# Altium schematic sheet Sheet1.SchDoc
size A2; SheetNumber: 1; SheetTotal: 1
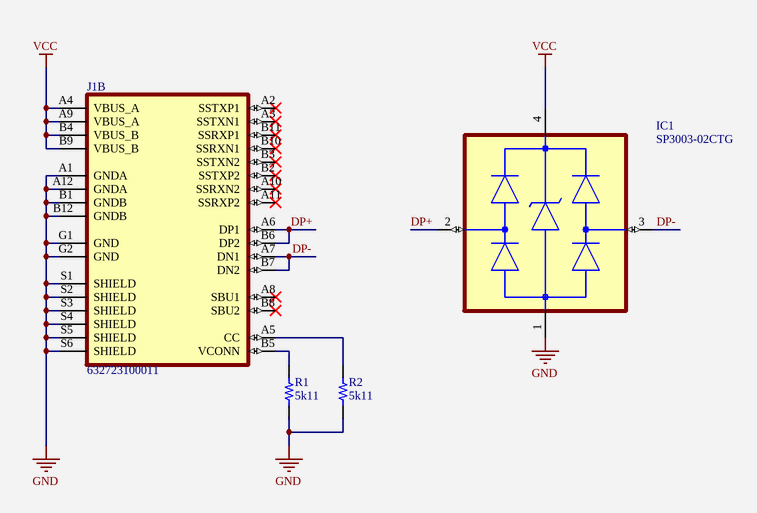
[diagram p0: Sheet1.SchDoc]

## Parts
IC1  SP3003-02CTG  [Littelfuse_SR05_MFG]
J1  632723100011  [WURTH_632723100011]  (part B of 2)
R1  5k11  [0603_R]
R2  5k11  [0603_R]

## Nets
GND: IC1.1(GND) J1.A1(GNDA) J1.A12(GNDA) J1.B1(GNDB) J1.B12(GNDB) J1.G1(GND) J1.G2(GND) J1.S1(SHIELD) J1.S2(SHIELD) J1.S3(SHIELD) J1.S4(SHIELD) J1.S5(SHIELD) J1.S6(SHIELD) R1.1 R2.1
VCC: IC1.4(VCC) J1.A4(VBUS_A) J1.A9(VBUS_A) J1.B4(VBUS_B) J1.B9(VBUS_B)
DP+: IC1.2(I/O_1) J1.A6(DP1) J1.B6(DP2)
DP-: IC1.3(I/O_2) J1.A7(DN1) J1.B7(DN2)
NetJ1_A5: J1.A5(CC) R2.2
NetJ1_B5: J1.B5(VCONN) R1.2

Not connected (* = marked no-connect by the designer): J1 A2(SSTXP1)* A3(SSTXN1)* A8(SBU1)* A10(SSRXN2)* A11(SSRXP2)* B2(SSTXP2)* B3(SSTXN2)* B8(SBU2)* B10(SSRXN1)* B11(SSRXP1)*

## Library data of the parts
IC1 = SP3003-02CTG: SR05 Series 5V 25A; Manufacture Name: Littelfuse; SPN: 576-SR05-02CTG; Category: ESD Suppressors; MPN: SP3003-02CTG; Supplier Name: Mouser; Value: *; Package: SOT143
J1 = 632723100011: USB-C _USB TYPE-C_ USB 3.1 _USB 3.1 Gen 2, Superspeed+_ Receptacle Connector 24 Position Surface Mount, Right Angle; Through Hole; Value: USB_Type_C; MF: Wurth Electronics; MP: 632723100011; Package: SMD_PTH; Category: Connector
R1 R2 = RC0603FR-075K11L: 5k11,  1% , 100ppm, 0.100W, 0603, SMD; Manufacturer: Yageo; TemperatureRange: -55C ~ 155C; TemperatureCoefficient: 100ppm/C; PowerRating: 0.100W, 1/10W; Value: 5k11; Part Number: RC0603FR-075K11L; Tolerance: 1%; Price: 0.0089; Device Package: 1608 (0603 Metric); Category: Resistor